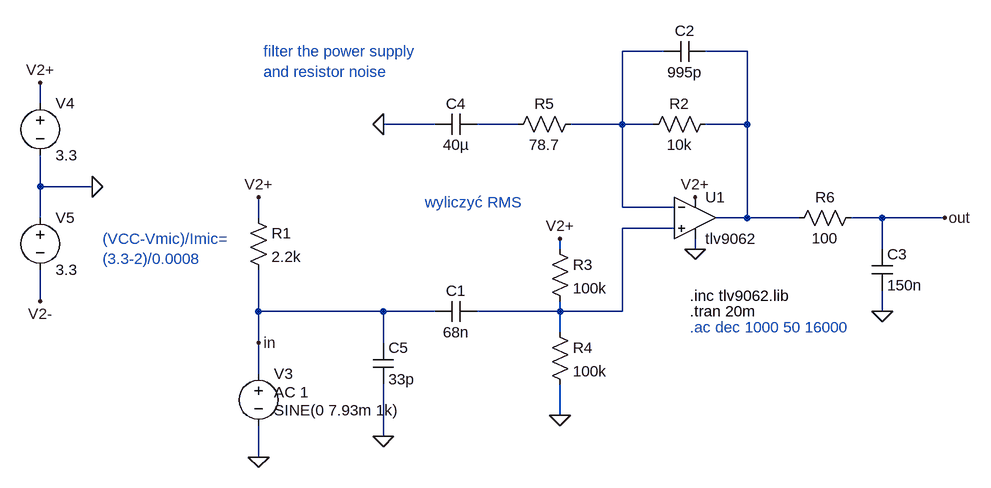
[diagram p0: schematic microphone_ampilier - Copy.asc]
microphone_ampilier - Copy.asc, the LTspice schematic file:
Version 4.1
SHEET 1 1596 680
WIRE 528 -16 464 -16
WIRE 656 -16 592 -16
WIRE -432 64 -432 32
WIRE 176 96 96 96
WIRE 304 96 240 96
WIRE 464 96 464 -16
WIRE 464 96 384 96
WIRE 512 96 464 96
WIRE 656 96 656 -16
WIRE 656 96 592 96
WIRE -432 192 -432 144
WIRE -352 192 -432 192
WIRE 464 224 464 96
WIRE 544 224 464 224
WIRE -432 240 -432 192
WIRE -96 240 -96 208
WIRE 656 240 656 96
WIRE 656 240 608 240
WIRE 736 240 656 240
WIRE 864 240 816 240
WIRE 960 240 864 240
WIRE 544 256 464 256
WIRE 368 288 368 272
WIRE 576 288 576 272
WIRE 864 288 864 240
WIRE -432 368 -432 320
WIRE -96 384 -96 320
WIRE 96 384 -96 384
WIRE 176 384 96 384
WIRE 368 384 368 368
WIRE 368 384 240 384
WIRE 464 384 464 256
WIRE 464 384 368 384
WIRE 864 384 864 352
WIRE 368 416 368 384
WIRE -96 432 -96 384
WIRE 96 432 96 384
WIRE -96 480 -96 432
WIRE 368 544 368 496
WIRE 96 576 96 496
WIRE -96 608 -96 560
FLAG -96 608 0
FLAG -96 208 V2+
FLAG -352 192 0
FLAG -432 32 V2+
FLAG -432 368 V2-
FLAG 368 272 V2+
FLAG 368 544 0
FLAG 960 240 out
FLAG -96 432 in
FLAG 96 96 0
FLAG 576 208 V2+
FLAG 576 288 0
FLAG 864 384 0
FLAG 96 576 0
SYMBOL OpAmps\\opamp2 576 176 R0
SYMATTR InstName U1
SYMATTR Value tlv9062
SYMBOL voltage -96 464 R0
WINDOW 123 24 44 Left 2
WINDOW 39 0 0 Left 0
WINDOW 3 24 72 Left 2
SYMATTR Value2 AC 1
SYMATTR Value SINE(0 7.93m 1k)
SYMATTR InstName V3
SYMBOL res -112 224 R0
SYMATTR InstName R1
SYMATTR Value 2.2k
SYMBOL cap 240 368 R90
WINDOW 0 0 32 VBottom 2
WINDOW 3 32 32 VTop 2
SYMATTR InstName C1
SYMATTR Value 68n
SYMBOL res 608 80 R90
WINDOW 0 0 56 VBottom 2
WINDOW 3 32 56 VTop 2
SYMATTR InstName R2
SYMATTR Value 10k
SYMBOL cap 592 -32 R90
WINDOW 0 0 32 VBottom 2
WINDOW 3 32 32 VTop 2
SYMATTR InstName C2
SYMATTR Value 995p
SYMBOL res 352 272 R0
SYMATTR InstName R3
SYMATTR Value 100k
SYMBOL voltage -432 48 R0
WINDOW 123 0 0 Left 0
WINDOW 39 0 0 Left 0
SYMATTR InstName V4
SYMATTR Value 3.3
SYMBOL voltage -432 224 R0
WINDOW 123 0 0 Left 0
WINDOW 39 0 0 Left 0
SYMATTR InstName V5
SYMATTR Value 3.3
SYMBOL res 352 400 R0
SYMATTR InstName R4
SYMATTR Value 100k
SYMBOL cap 176 112 R270
WINDOW 0 32 32 VTop 2
WINDOW 3 0 32 VBottom 2
SYMATTR InstName C4
SYMATTR Value 40µ
SYMBOL res 400 80 R90
WINDOW 0 0 56 VBottom 2
WINDOW 3 32 56 VTop 2
SYMATTR InstName R5
SYMATTR Value 78.7
SYMBOL cap 848 288 R0
SYMATTR InstName C3
SYMATTR Value 150n
SYMBOL res 832 224 R90
WINDOW 0 0 56 VBottom 2
WINDOW 3 32 56 VTop 2
SYMATTR InstName R6
SYMATTR Value 100
SYMBOL cap 80 432 R0
SYMATTR InstName C5
SYMATTR Value 33p
TEXT 568 360 Left 2 !.inc tlv9062.lib
TEXT 568 384 Left 2 !.tran 20m
TEXT 160 216 Left 2 ;wyliczyć RMS
TEXT 568 408 Left 2 ;.ac dec 1000 50 16000
TEXT -336 272 Left 2 ;(VCC-Vmic)/Imic= \n(3.3-2)/0.0008
TEXT -88 -16 Left 2 ;filter the power supply \nand resistor noise

The netlist it stands for:
* microphone_ampilier - Copy.asc
X§U1 N004 N001 V2+ 0 N002 tlv9062  ; pins In+ In- V+ V- OUT
V3 in 0 SINE(0 7.93m 1k) AC 1
R1 V2+ in 2.2k
C1 N004 in 68n
R2 N002 N001 10k
C2 N002 N001 995p
R3 V2+ N004 100k
V4 V2+ 0 3.3
V5 0 V2- 3.3
R4 N004 0 100k
C4 0 N003 40µ
R5 N001 N003 78.7
C3 out 0 150n
R6 out N002 100
C5 in 0 33p
.inc tlv9062.lib
.tran 20m
* wyliczyć RMS
* .ac dec 1000 50 16000
* (VCC-Vmic)/Imic=
* (3.3-2)/0.0008
* filter the power supply
* and resistor noise
.backanno
.end